# Altium project FYP_VOC_board.PrjPcb
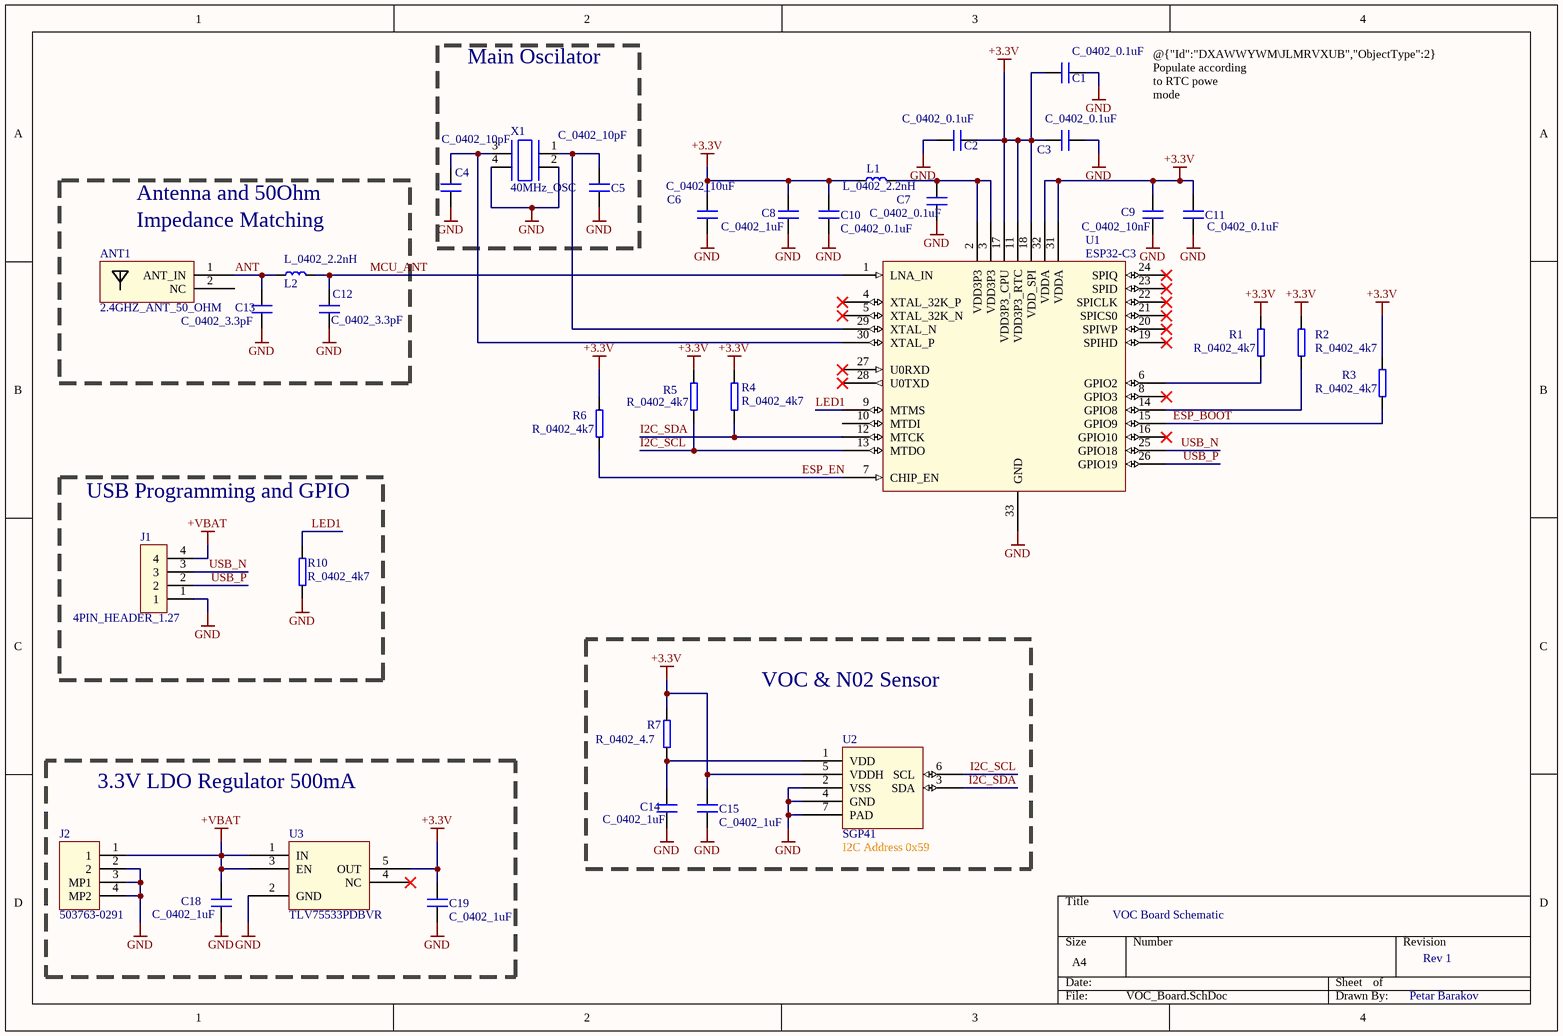
[diagram p0: VOC_Board.SchDoc]
Author: Petar Barakov; Revision: Rev 1
1 sheet, 34 parts. Net scope: global (net labels, ports and power ports of the same name join across sheets).
Board file: VOC_Board.PcbDoc

## Sheet VOC_Board.SchDoc
size A4; SheetNumber: 1; SheetTotal: 1

### Parts
ANT1  2.4GHZ_ANT_50_OHM  [Chip2PinSM127P600-8N]
C1  C_0402_0.1uF  [C_0402]
C2  C_0402_0.1uF  [C_0402]
C3  C_0402_0.1uF  [C_0402]
C4  C_0402_10pF  [C_0402]
C5  C_0402_10pF  [C_0402]
C6  C_0402_10uF  [C_0402]
C7  C_0402_0.1uF  [C_0402]
C8  C_0402_1uF  [C_0402]
C9  C_0402_10nF  [C_0402]
C10  C_0402_0.1uF  [C_0402]
C11  C_0402_0.1uF  [C_0402]
C12  C_0402_3.3pF  [C_0402]
C13  C_0402_3.3pF  [C_0402]
C14  C_0402_1uF  [C_0402]
C15  C_0402_1uF  [C_0402]
C18  C_0402_1uF  [C_0402]
C19  C_0402_1uF  [C_0402]
J1  4PIN_HEADER_1.27  [4PIN_HEADER_1.27-Footprint-1]
J2  503763-0291  [Molex 503763-0291]
L1  L_0402_2.2nH  [L_0402]
L2  L_0402_2.2nH  [L_0402]
R1  R_0402_4k7  [R_0402]
R2  R_0402_4k7  [R_0402]
R3  R_0402_4k7  [R_0402]
R4  R_0402_4k7  [R_0402]
R5  R_0402_4k7  [R_0402]
R6  R_0402_4k7  [R_0402]
R7  R_0402_4.7  [R_0402]
R10  R_0402_4k7  [R_0402]
U1  ESP32-C3  [QFN127P600-8N]
U2  SGP41  [SGP41-D-R4-Footprint-2]
U3  TLV75533PDBVR  [SOT95P280X145-5N]
X1  40MHz_OSC  [40MHz_OSC-Footprint-1]

### Blocks framed on the sheet
Main Oscilator: C4 C5 X1
USB Programming and GPIO: J1 R10
VOC & N02 Sensor: C14 C15 R7 U2
3.3V LDO Regulator 500mA: C18 C19 J2 U3

### Nets
+3.3V: C1.1 C2.2 C3.1 C6.2 C8.2 C9.2 C10.1 C11.2 C15.2 C19.2 L1.1 R1.1 R2.1 R3.1 R4.1 R5.1 R6.1 R7.1 U1.11(VDD3P3_RTC) U1.17(VDD3P3_CPU) U1.18(VDD_SPI) U1.31(VDDA) U1.32(VDDA) U2.5(VDDH) U3.5(OUT)
+VBAT: C18.2 J1.4 J2.1 U3.1(IN) U3.3(EN)
GND: C1.2 C2.1 C3.2 C4.1 C5.1 C6.1 C7.2 C8.1 C9.1 C10.2 C11.1 C12.1 C13.1 C14.1 C15.1 C18.1 C19.1 J1.1 J2.2 J2.3(MP1) J2.4(MP2) R10.2 U1.33(GND) U2.2(VSS) U2.4(GND) U2.7(PAD) U3.2(GND) X1.2 X1.4
ANT: ANT1.1(ANT_IN) C13.2 L2.1
ESP_BOOT: R3.2 U1.15(GPIO9)
ESP_EN: R6.2 U1.7(CHIP_EN)
I2C_SCL: R5.2 U1.13(MTDO) U2.6(SCL)
I2C_SDA: R4.2 U1.12(MTCK) U2.3(SDA)
LED1: R10.1 U1.9(MTMS)
MCU_ANT: C12.2 L2.2 U1.1(LNA_IN)
USB_N: J1.3 U1.25(GPIO18)
USB_P: J1.2 U1.26(GPIO19)
NetC4_2: C4.2 U1.30(XTAL_P) X1.3
NetC5_2: C5.2 U1.29(XTAL_N) X1.1
NetC7_1: C7.1 L1.2 U1.2(VDD3P3) U1.3(VDD3P3)
NetC14_2: C14.2 R7.2 U2.1(VDD)
NetR1_2: R1.2 U1.6(GPIO2)
NetR2_2: R2.2 U1.14(GPIO8)

Not connected (* = marked no-connect by the designer): ANT1 2(NC); U1 4(XTAL_32K_P)* 5(XTAL_32K_N)* 8(GPIO3)* 10(MTDI) 16(GPIO10)* 19(SPIHD)* 20(SPIWP)* 21(SPICS0)* 22(SPICLK)* 23(SPID)* 24(SPIQ)* 27(U0RXD)* 28(U0TXD)*; U3 4(NC)*

### Notes on the sheet
- @{"Id":"DXAWWYWM\JLMRVXUB","ObjectType":2}  Populate according to RTC powe mode configurations
- Antenna and 50Ohm
- Impedance Matching
- (near U2) I2C Address 0x59
- VOC Board Schematic

### Library data of the parts
ANT1 = CMP-00009-6: 2.4GHz Chip Antenna 50 Ohm Impedance ANT2012LL00R2400A; Order Code: 603-ANT2012LL00R2400; Distributor: Mouser
C1-C3 C7 C10 C11 = CMP-00055-1: JLC Part Number: C1525
C4 C5 = CMP-00051-1: JLC Part Number: C32949
C6 = CMP-00052-1: JLC Part Number: C15525
C8 C14 C15 C18 C19 = CMP-00053-2: Order Code: 581-0402ZD105KAT4A; JLC Part Number: C52923; Distributor: Mouser
C9 = CMP-00054-1: JLC Part Number: C15195
C12 C13 = CMP-00056-1: JLC Part Number: C326841
J1 = CMP-00049-2: Order Code: 855-M50-3530442; Distributor: Mouser
J2 = CMP-007-000000-2: Molex 503763-0291; Order Code: 538-503763-0291; Design Item ID: 503763-0291; Distributor: Mouser
L1 L2 = CMP-00057-1: JLC Part Number: C92035
R1-R6 R10 = CMP-00050-1: JLC Part Number: C25900
R7 = CMP-00065-1: JLC Part Number: C137962
U1 = CMP-00008-4: 33 pin ESP32_C3 Microcontroller; JLC Part Number: C2858491
U2 = CMP-00000-7: Air Quality Sensors VOC and NOx (MOX) Gas Pollutant Sensor; Order Code: 403-SGP41-D-R4; JLC Part Number: C3659325; Distributor: Mouser
U3 = CMP-00019-2: LDO Voltage Regulators 500-mA high-PSRR low-IQ low-dropout voltage regulator with enable 5-SOT-23 -40 to 125; JLC Part Number: C404027
X1 = CMP-00029-2: 40 MHZ Oscillator, 10pF load capacitance; JLC Part Number: C426988

## Assembly variants
V1: not fitted ANT1 C14 C15 J1 J2 R10 U2
V2_3d: not fitted J1 R10